# EAGLE design WIMv2 (EAGLE 7.7.0)
COMPANY: ADAFRUIT INDUSTRIES; DRAWN: KTOWN; REV: F
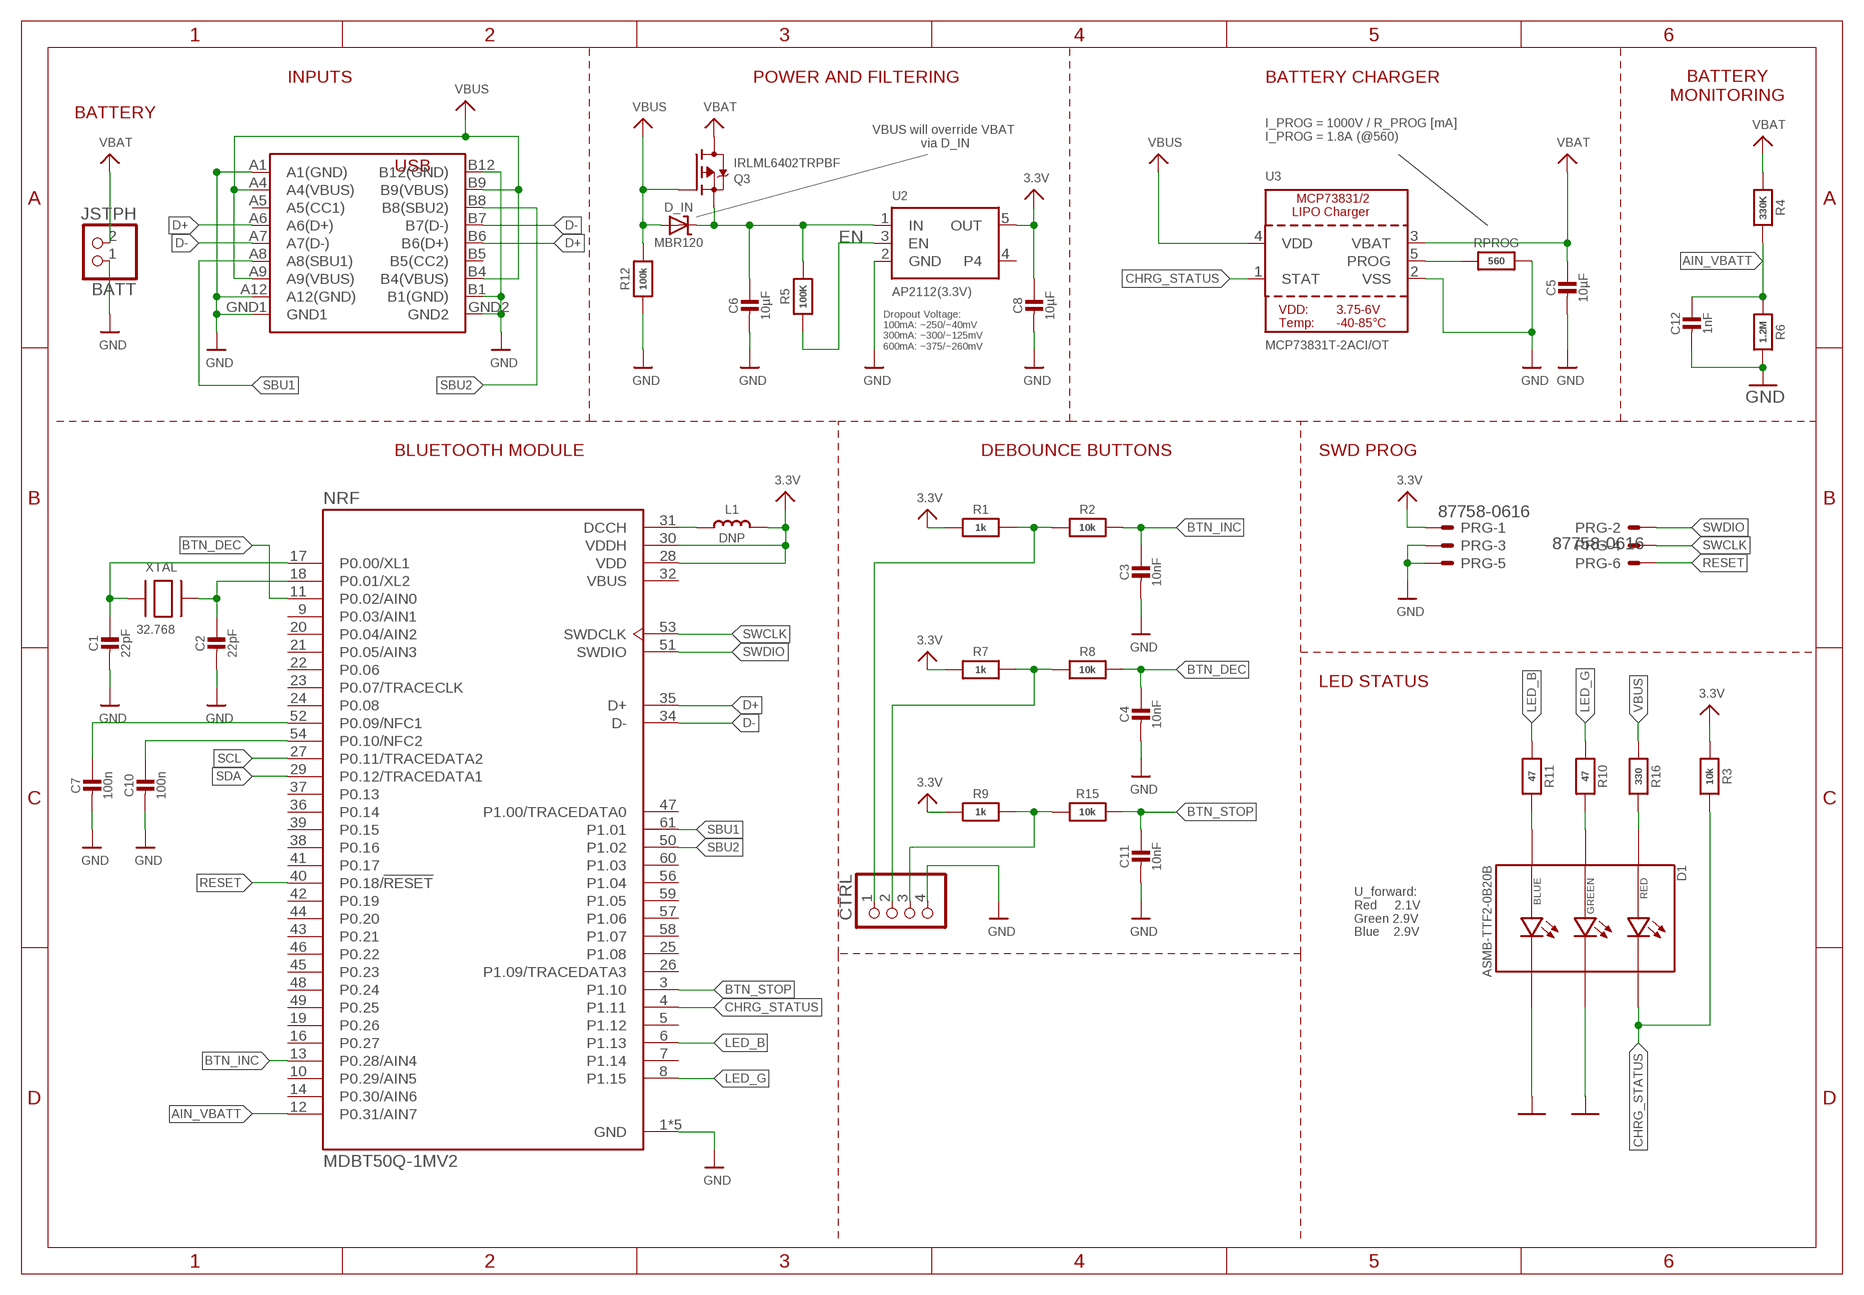
[diagram p0: schematic, sheet 1]

## Parts
BATT  JSTPH  CON_JST_PH_2PIN  [JSTPH2]
C1  22pF  CAP_CERAMIC0603_NO  [0603-NO]
C2  22pF  CAP_CERAMIC0603_NO  [0603-NO]
C3  10nF  CAP_CERAMIC0603_NO  [0603-NO]
C4  10nF  CAP_CERAMIC0603_NO  [0603-NO]
C5  10µF  CAP_CERAMIC0805-NOOUTLINE  [0805-NO]
C6  10µF  CAP_CERAMIC0805-NOOUTLINE  [0805-NO]
C7  100n  CAP_CERAMIC0603_NO  [0603-NO]
C8  10µF  CAP_CERAMIC0805-NOOUTLINE  [0805-NO]
C10  100n  CAP_CERAMIC0603_NO  [0603-NO]
C11  10nF  CAP_CERAMIC0603_NO  [0603-NO]
C12  1nF  CAP_CERAMIC0603_NO  [0603-NO]
CTRL  PINHD-1X4/90  [1X04/90]
D1  ASMB-TTF2-0B20B  [LED_ASMB-TTF2-0B20B]
D_IN  MBR120  DIODE-SCHOTTKYSOD-123  [SOD-123]
L1  DNP  INDUCTOR_0805MP  [_0805MP]
NRF  MDBT50Q-1MV2  [XCVR_MDBT50Q-1MV2]
PRG  87758-0616  [87758-0616]
Q3  IRLML6402TRPBF  MOSFET-P  [SOT23-R]
R1  1k  RESISTOR_0603_NOOUT  [0603-NO]
R2  10k  RESISTOR_0603_NOOUT  [0603-NO]
R3  10k  RESISTOR_0603_NOOUT  [0603-NO]
R4  330K  RESISTOR_0603_NOOUT  [0603-NO]
R5  100K  RESISTOR_0603_NOOUT  [0603-NO]
R6  1.2M  RESISTOR_0603_NOOUT  [0603-NO]
R7  1k  RESISTOR_0603_NOOUT  [0603-NO]
R8  10k  RESISTOR_0603_NOOUT  [0603-NO]
R9  1k  RESISTOR_0603_NOOUT  [0603-NO]
R10  47  RESISTOR_0603_NOOUT  [0603-NO]
R11  47  RESISTOR_0603_NOOUT  [0603-NO]
R12  100k  RESISTOR_0603_NOOUT  [0603-NO]
R15  10k  RESISTOR_0603_NOOUT  [0603-NO]
R16  330  RESISTOR_0603_NOOUT  [0603-NO]
RPROG  560  RESISTOR_0603_NOOUT  [0603-NO]
U2  AP2112(3.3V)  VREG_SOT23-5  [SOT23-5]
U3  MCP73831T-2ACI/OT  MCP73831/2  [SOT23-5]
USB-C  USB-C  203615-0003  [203615-0003]
XTAL  32.768  XTAL-3.2X1.5  [XTAL3215]

## Nets
3.3V: C8.1 L1.2 NRF.28(VDD) NRF.30(VDDH) PRG.1 R1.1 R3.1 R7.1 R9.1 U2.5(OUT)
AIN_VBATT: C12.1 NRF.12(P0.31/AIN7) R4.2 R6.1
BTN_DEC: C4.1 NRF.11(P0.02/AIN0) R8.2
BTN_INC: C3.1 NRF.13(P0.28/AIN4) R2.2
BTN_STOP: C11.1 NRF.3(P1.10) R15.2
CHRG_STATUS: D1.2(R_C) NRF.4(P1.11) R3.2 U3.1(STAT)
D+: NRF.35(D+) USB-C.A6(A6(D+)) USB-C.B6(B6(D+))
D-: NRF.34(D-) USB-C.A7(A7(D-)) USB-C.B7(B7(D-))
DCCH: L1.1 NRF.31(DCCH)
EN: R5.1 U2.3(EN)
GND [power]: BATT.1 C1.2 C2.2 C3.2 C4.2 C5.2 C6.2 C7.2 C8.2 C10.2 C11.2 C12.2 CTRL.4 D1.4(G_C) D1.6(B_C) NRF.1(GND) NRF.2(GND) NRF.15(GND) NRF.33(GND) NRF.55(GND) PRG.3 PRG.5 R6.2 R12.1 RPROG.2 U2.2(GND) U3.2(VSS) USB-C.A1(A1(GND)) USB-C.A12(A12(GND)) USB-C.B1(B1(GND)) USB-C.B12(B12(GND)) USB-C.GND1 USB-C.GND2
LED_B: NRF.6(P1.13) R11.1
LED_G: NRF.8(P1.15) R10.1
N$1: C1.1 NRF.17(P0.00/XL1) XTAL.P$1
N$2: C2.1 NRF.18(P0.01/XL2) XTAL.P$2
N$3: CTRL.1 R1.2 R2.1
N$4: CTRL.3 R9.2 R15.1
N$5: CTRL.2 R7.2 R8.1
N$7: D1.3(G_A) R10.2
N$8: D1.5(B_A) R11.2
N$10: RPROG.1 U3.5(PROG)
N$12: D1.1(R_A) R16.2
N$17: C7.1 NRF.52(P0.09/NFC1)
N$18: C10.1 NRF.54(P0.10/NFC2)
RESET: NRF.40(P0.18/!RESET) PRG.6
SBU1: NRF.61(P1.01) USB-C.A8(A8(SBU1))
SBU2: NRF.50(P1.02) USB-C.B8(B8(SBU2))
SCL: NRF.27(P0.11/TRACEDATA2)
SDA: NRF.29(P0.12/TRACEDATA1)
SWCLK: NRF.53(SWDCLK) PRG.4
SWDIO: NRF.51(SWDIO) PRG.2
VBAT [power]: BATT.2 C5.1 Q3.3(D) R4.1 U3.3(VBAT)
VBUS: D_IN.A Q3.1(G) R12.2 R16.1 U3.4(VDD) USB-C.A4(A4(VBUS)) USB-C.A9(A9(VBUS)) USB-C.B4(B4(VBUS)) USB-C.B9(B9(VBUS))
VIN: C6.1 D_IN.C Q3.2(S) R5.2 U2.1(IN)
Unconnected: NRF.5(P1.12) NRF.7(P1.14) NRF.9(P0.03/AIN1) NRF.10(P0.29/AIN5) NRF.14(P0.30/AIN6) NRF.16(P0.27) NRF.19(P0.26) NRF.20(P0.04/AIN2) NRF.21(P0.05/AIN3) NRF.22(P0.06) NRF.23(P0.07/TRACECLK) NRF.24(P0.08) NRF.25(P1.08) NRF.26(P1.09/TRACEDATA3) NRF.36(P0.14) NRF.37(P0.13) NRF.38(P0.16) NRF.39(P0.15) NRF.41(P0.17) NRF.42(P0.19) NRF.43(P0.21) NRF.44(P0.20) NRF.45(P0.23) NRF.46(P0.22) NRF.47(P1.00/TRACEDATA0) NRF.48(P0.24) NRF.49(P0.25) NRF.56(P1.04) NRF.57(P1.06) NRF.58(P1.07) NRF.59(P1.05) NRF.60(P1.03) U2.4 USB-C.A5(A5(CC1)) USB-C.B5(B5(CC2))

## Notes on the sheet
- INPUTS | POWER AND FILTERING | BATTERY CHARGER
- BATTERY
  MONITORING
- BATTERY
- VBUS will override VBAT 
  via D_IN
- I_PROG = 1000V / R_PROG [mA]
  I_PROG = 1.8A (@560)
- USB
- Dropout Voltage:
  100mA: ~250/~40mV
  300mA: ~300/~125mV
  600mA: ~375/~260mV
- BLUETOOTH MODULE | DEBOUNCE BUTTONS | SWD PROG
- LED STATUS
- U_forward:
  Red     2.1V
  Green 2.9V
  Blue    2.9V

## Power pins joined to a net without a drawn wire
VBUS: NRF.32(VBUS)

## Library data of the parts
BATT = microbuilder:CON_JST_PH_2PIN: JST 2-Pin Right-Angle Connector PH-Series - 4UConnector: 17311 SH-Series - 4UConnector: 07278
C1-C8 C10-C12 = microbuilder:CAP_CERAMIC: Ceramic Capacitors For new designs, use the packages preceded by an '_' character since they are more reliable: The following footprints should be used on most boards: _0402 - Standard footprint for regular board layouts _0603 - Standard footprint for regular board layouts _0805 - Standard footprint for regular board layouts _1206 - Standard footprint for regular board layouts For extremely tight-pitch boards where space is at a premium, the following 'micro-pitch' footprints can be used (smaller pads, no silkscreen outline, etc.): _0402MP - Micro-pitch footprint for very dense/compact boards _0603MP - Micro-pitch footprint for very dense/compact boards _0805MP - Micro-pitch footprint for very dense/compact boards _1206MP - Micro-pitch footprint for very dense/compact boards
CTRL = pinhead:PINHD-1X4: PIN HEADER
D1 = ASMB-TTF2-0B20B:ASMB-TTF2-0B20B: Check availability <https://pricing.snapeda.com/parts/ASMB-TTF2-0B20B/Broadcom%20/%20Avago/view-part?ref=eda>; AVAILABILITY: In Stock; DESCRIPTION: LED RGB DIFFUSED 6PLCC SMD; MF: Broadcom / Avago; MP: ASMB-TTF2-0B20B; PACKAGE: None; PRICE: None; PURCHASE-URL: https://pricing.snapeda.com/search/part/ASMB-TTF2-0B20B/?ref=eda
D_IN = microbuilder:DIODE-SCHOTTKY
L1 = microbuilder:INDUCTOR: Inductors 0603: 10nH Ceramic Inductor - microwire antenna/RF (Digikey: 712-1434-2-ND) 0805: 560nH Ceramic Inductor - RF (Digikey: 553-1047-1-ND) 270nH Ceramic Inductor - Q = 40@250MHz, +-5%, 1 Ohm DC Resistance (Digikey: 535-10506-2-ND) 1007 (2518 Metric) SMT: 10µH 10% 250mOhm 820mA 1007 Inductor (Digikey: 587-2189-1-ND) 22µH 10% 500mOhm 580mA 1007 Inductor (Digikey: 587-2190-1-ND) 47µH 10% 950mOhm 420mA 1007 Inductor (Digikey: 587-2191-1-ND) 47µH 5% 100mOhm 1A 1008 Inductor (Digikey: 732-1816-1-ND) 5.0x5.0mm (Taiyo Yuden NR5040 Series) 6.8µH 20% 2.3A 64mOhm Inductor (Digikey: 587-2374-2-ND) 5.0x5.0mm (TDK VLC5045 Series) 4.7µH 20% 3.3A 34mOhm Inductor (Digikey: 445-6526-1-ND) 6.8µH 20% 2.7A 46mOhm Inductor (Digikey: 445-6527-1-ND) 6.0x6.0mm (TDK VLC6045 Series) 4.7µH 20% 3.8A 27mOhm Inductor (Digikey: 445-6538-2-ND) 6.8µH 20% 3A 41mOhm Inductor (Digikey: 445-6540-1-ND) 6.2µH 30% 2.2A 45mOhm Inductor (Digikey: SRR5028-6R2YCT-ND) - Not TDK VLC6045 but footprint should match 6.0x6.0mm (TDK SLF6045 Series) 6.8uH 30% 2A 33mOhm Inductor (Digikey: 445-4572-1-ND, Mouser: 810-SLF645T6R8N2R0PF) 6.0x6.0mm (Sumida CDRH5D28 Series) 6.2uH 30% 1.8A 45mOhm Inductor (Digikey: 308-1542-1-ND) Taiyo Yuden NR3015T2R2M - 2.2uH 20% 1.5A (Digikey: 587-1648-2-ND, Mouser: 963-NR3015T2R2M) - Used with TI TPS62172 CoilCraft RFID Transponder Coil - MA5532-AE (For use with AS3935 Lightning Sensor) Taiyo Yuden NRH2412T2R2MNGH - 2.2uH 20% 1AA (Digikey: 587-3443-1-ND) - Used with TI LM3671 Vishay IHLP 1.0uH Molded Inductor - 24mOhm DCR, 5A, +/-20%, -55°C-125°C (Digikey: 541-1319-1-ND)
NRF = MDBT50Q-1MV2:MDBT50Q-1MV2: Embedded 2.4GHz transceiver support Bluetooth V5.0 and 802.15.4 Check availability <https://pricing.snapeda.com/parts/MDBT50Q-1MV2/Raytac%20Corporation/view-part?ref=eda>; AVAILABILITY: In Stock; DESCRIPTION: 802.15.4, Bluetooth Bluetooth v5.2, Zigbee® Transceiver Module 2.36GHz ~ 2.5GHz Integrated, Chip Surface Mount; MF: Raytac Corporation; MP: MDBT50Q-1MV2; PACKAGE: SMD-61 Raytac Corporation; PRICE: None; PURCHASE-URL: https://pricing.snapeda.com/search/part/MDBT50Q-1MV2/?ref=eda
PRG = con-molex:87758-0616: 6 Pin - 2mm Dual Row Single Wafer, Vertical T/H HDR Source: http://www.molex.com/pdm_docs/sd/877580616_sd.pdf; MPN: 87758-0616; OC_FARNELL: 7472323; OC_NEWARK: 25M5667
Q3 = microbuilder:MOSFET-P: P-Channel Mosfet LEGEND VDS: Voltage Drain-Source ID: Drain Current RDS(ON): Drain-Source On-State Resistance VGS(TH): Gate-Source Threshold Voltage CISS: Drain-Source Input Capacitance SOT-23 Name VDS ID RDS(ON) VGS(TH) CISS Order Number IRLML5103 30V 760mA 600 mOhm -- 75pF @ 25V Digikey: IRLML5103PBFCT-ND IRLML6401 12V 4.3A 50 mOhm 950mV @ 250µA 830pF @ 10V Digikey: IRLML6401PBFTR-ND NTR0202PL 20V 400mA 800 mOhm 2.3V @ 250uA 70pF @ 5V Digikey: NTR0202PLT1GOSTR-ND NTR4101PT1G 20V 1.8A 85 mOhm 1.2V @ 250uA 675pF @ 10V Digikey: NTR4101PT1GOSCT-ND DMP2004K 20V 600mA 900 mOhm 1V @ 250uA 175pF @ 16V Digikey: DMP2004KDICT-ND PMV65XP 20V 3.9A 76 mOhm 950mV @ 1mA 725pF @ 20V Digikey: 568-2358-2-ND TO-252 Name VDS ID RDS(ON) VGS(TH) CISS Order Number AOD417 30V 25A 34 mOhm 3V @ 250µA 920pF @ 15V Digikey: 785-1106-2-ND PowerPak Name VDS ID RDS(ON) VGS(TH) CISS Order Number AON7401 30V 12A 14 mOhm 3V @ 250µA 2600pF @ 15V Digikey: 785-1302-1-ND
R1-R12 R15 R16 RPROG = microbuilder:RESISTOR: Resistors For new designs, use the packages preceded by an '_' character since they are more reliable: The following footprints should be used on most boards: _0402 - Standard footprint for regular board layouts _0603 - Standard footprint for regular board layouts _0805 - Standard footprint for regular board layouts _1206 - Standard footprint for regular board layouts For extremely tight-pitch boards where space is at a premium, the following 'micro-pitch' footprints can be used (smaller pads, no silkscreen outline, etc.): _0402MP - Micro-pitch footprint for very dense/compact boards _0603MP - Micro-pitch footprint for very dense/compact boards _0805MP - Micro-pitch footprint for very dense/compact boards _1206MP - Micro-pitch footprint for very dense/compact boards
U2 = microbuilder:VREG_SOT23-5: SOT23-5 Fixed Voltage Regulators Part Current Out V Out V In V Dropout θJA (°C/W) TJ (°C) Digikey Part No. ADP121 150mA 3.3V 3.4-5.5V 0.09V @ 150mA -- -- ADP121-AUJZ33R7CT-ND ADP121 150mA 3.0V 3.1-5.5V 0.09V @ 150mA -- -- ADP121-AUJZ30R7CT-ND ADP122 300mA 3.3V 3.4-5.5V 0.085V @ 300mA -- -- ADP122AUJZ-3.3-R7CT-ND ADP1712 300mA 3.3V 3.5-5.5V 0.17V @ 300mA -- -- ADP1712AUJZ-3.3-R7TR-ND AP7311 (Low Cost) 150mA 3.3V 3.5-6V 0.15V @ 150mA -- -- AP7311-33WG-7DICT-ND LD39015M18R 150mA 1.8V 1.9V-5.5V 0.08V @ 100mA -- -- 497-6977-1-ND LP2985A-33DBVR 150mA 3.3V 3.3-16V 0.28V @ 150mA 206 150 296-18479-1-ND MCP1824T-3302E/OT 300mA 3.3V 3.5V-6V 0.2V @ 300mA -- -- MCP1824T-3302E/OTCT-ND MIC5205-2.5YM5 TR 150mA 2.5V 2.7-16V 0.165V @ 150mA -- -- 576-1257-2-ND MIC5205-3.0YM5 TR 150mA 3.0V 3.2V-16V 0.165V @ 150mA -- -- 576-1258-2-ND MIC5205-3.3YM5 TR 150mA 3.3V 3.5V-16V 0.165V @ 150mA -- -- 576-1259-2-ND TPS780330220 150mA 3.3V+2.2V 3.6-5.5V 250mV Max -- -- 296-23332-1-ND TDA3663/N1,135 100mA 3.3V 3.5-45V 0.18V @ 50mA -- -- 568-5343-1-ND Max operating temp can be calculated using θJA, TJ (max junction temperature), and power in watts. Set the "Maximum Ambient Temperature" until it reaches TJ ("Max Junction Temperature"), which is the absolute limit for safe use of the regulator: Heat Sink Temperature Calculator <http://www.daycounter.com/Calculators/Heat-Sink-Temperature-Calculator.phtml> For example, With 12V source into a 3.3V LP2985 and a 30mA load, we are dissipating (12V-3.3V) * 0.03A = 0.261W. With a θJA of 206 °C/W, a TJ of 150°C, and 261mW we can safely use the chip without a heat sink up to 75°C (=147.1°C Junction Temperature).
U3 = microbuilder:MCP73831/2: MCP73831/2 LIPO Charger VDD: 3.75 - 6V Temp -40 - 85°C Programmable Charge Rate: 15-500mA NOTE: STAT is a tri-state logic output on the MCP73831 and an open-drain output on the MCP73832. SOT23-5 with 4.2V output and tri-state logic on STAT = MCP73831T-2ACI/OT
USB-C = christian:203615-0003
XTAL = adafruit2:XTAL: Low cost SMT crystals, no capacitors included http://www.ladyada.net/library/eagle

## Net classes
1 power: width 0.254 mm
3 usbvcc: width 0.305 mm, drill 0.483 mm, clearance 0.203 mm

## Board
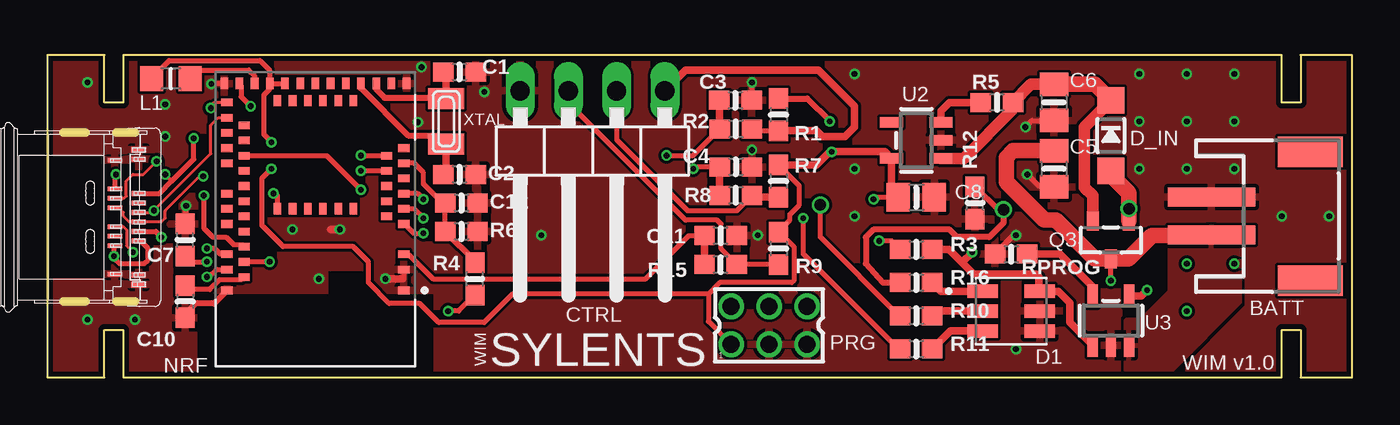
[diagram p1: board, top side]
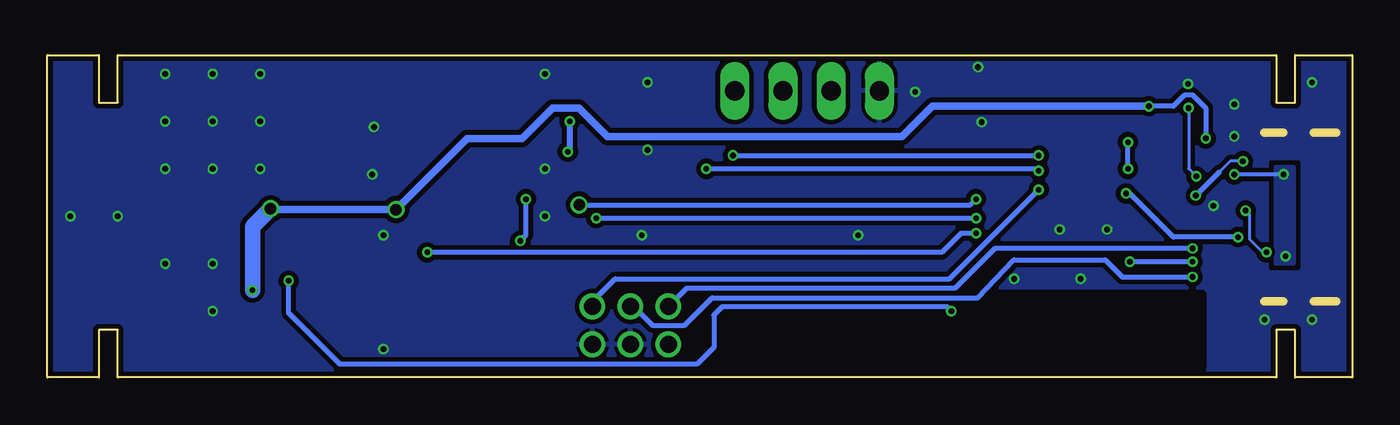
[diagram p2: board, bottom side, seen from below]

Size 68.7 x 17 mm. Coordinates in mm from the lower left corner, seen from the top.
Outline: 0,0 3,0 3,2.5 4,2.5 4,0 65,0 65,2.5 66,2.5 66,0 68.7,0 68.7,17 66,17 66,14.5 65,14.5 65,17 4,17 4,14.5 3,14.5 3,17 0,17 0,0
Copper layers (1*16): Top 0.018mm / dielectric 1.55mm / Bottom 0.018mm
Design rules "eC_2Layer_PClass6_BaseCopperO18_eCDefault": minimum track width 0.15mm, minimum drill 0.35mm, track to track 0.15mm, track to pad 0.15mm, pad to pad 0.15mm, via to via 0.15mm, smd to smd 0mil, copper to edge 0.25mm, drill to drill 0.35mm, minimum pad ring 0.175mm, minimum via ring 0.125mm, stop-mask expansion 0mil, vias tented up to drill 0.45mm, thermal gap 0.2mm

### Footprints (pad centres in the part's own frame; a part is rotated, then mirrored left to right if it is on the bottom)
JSTPH2 = smd 1 x 4.6: 1 -1,-3.7; 2 1,-3.7 | smd 1.6 x 3.4: NC1 -3.4,1.5; NC2 3.4,1.5
0603-NO = smd 1.075 x 1: 1 -0.85,0; 2 0.85,0
0805-NO = smd 1.24 x 1.5: 1 -0.95,0; 2 0.95,0
1X04/90 = drill 1.016 long: 1 -3.81,-3.81; 2 -1.27,-3.81; 3 1.27,-3.81; 4 3.81,-3.81
LED_ASMB-TTF2-0B20B = smd 1.6 x 0.7: 1 -1.5,1.05; 2 1.5,1.05; 3 -1.5,0; 4 1.5,0; 5 -1.5,-1.05; 6 1.5,-1.05
SOD-123 = smd 1.4 x 1.4: A 1.85,0; C -1.85,0
_0805MP = smd 1.2 x 1.3: 1 -1.016,0; 2 1.016,0
XCVR_MDBT50Q-1MV2 = smd 0.6 x 0.4: 1 -4.65,3.75; 2 -4.65,2.65; 3 -4.65,1.85; 4 -4.65,0.25; 5 -3.75,-0.15; 6 -4.65,-0.55; 7 -3.75,-0.95; 8 -4.65,-1.35; 9 -3.75,-1.75; 10 -4.65,-2.15; 11 -3.75,-2.55; 12 -4.65,-2.95; 13 -3.75,-3.35; 14 -4.65,-3.75; 34 4.65,-6.15; 35 4.65,-5.35; 36 3.75,-4.95; 37 4.65,-4.55; 38 3.75,-4.15; 39 4.65,-3.75; 40 3.75,-3.35; 41 4.65,-2.95; 42 3.75,-2.55; 43 3.75,-1.75; 44 4.65,-1.35; 45 3.75,-0.95; 46 4.65,-0.55; 47 3.75,-0.15; 48 4.65,0.25; 49 3.75,0.65; 50 3.75,1.45; 51 4.65,1.85; 52 3.75,2.25; 53 4.65,2.65; 54 3.75,3.05; 55 4.65,3.75 | smd 0.4 x 0.6: 15 -4.8,-7.15; 16 -4,-7.15; 17 -3.2,-7.15; 18 -2.4,-7.15; 19 -2,-6.25; 20 -1.6,-7.15; 21 -1.2,-6.25; 22 -0.8,-7.15; 23 -0.4,-6.25; 24 0,-7.15; 25 0.4,-6.25; 26 0.8,-7.15; 27 1.2,-6.25; 28 1.6,-7.15; 29 2,-6.25; 30 2.4,-7.15; 31 3.2,-7.15; 32 4,-7.15; 33 4.8,-7.15; 56 -2,-0.55; 57 -1.2,-0.55; 58 -0.4,-0.55; 59 0.4,-0.55; 60 1.2,-0.55; 61 2,-0.55
87758-0616 = drill 0.9 pad 1.27: 1 -2,-1; 2 -2,1; 3 0,-1; 4 0,1; 5 2,-1; 6 2,1
SOT23-R = smd 0.635 x 1.016: 1 -0.95,-1; 2 0.95,-1; 3 0,1
SOT23-5 = smd 0.55 x 1.2: 1 -0.95,-1.3; 2 0,-1.3; 3 0.95,-1.3; 4 0.95,1.3; 5 -0.95,1.3
203615-0003 = smd 0.25 x 0.75: A1 -3.05,7.5; A4 -1.25,7.5; A5 -0.75,7.5; A6 -0.25,7.5; A7 0.25,7.5; A8 0.75,7.5; A9 1.25,7.5; A12 3.05,7.5; B1 3,6.25; B4 1.5,6.25; B5 1,6.25; B6 0.5,6.25; B7 -0.5,6.25; B8 -1,6.25; B9 -1.5,6.25; B12 -3,6.25 | smd 0.3 x 0.8: GND1 -3.55,7.5; GND2 3.55,7.5
XTAL3215 = smd 1.1 x 1.9: P$1 1.2,0; P$2 -1.2,0

### Placement (x,y rotation side)
BATT  65,8.5 270 top
C1  21.7,16.1 0 top
C2  21.7,10.7 0 top
C3  36.23,14.61 0 top
C4  36.25,11.1 0 top
C5  53,11 270 top
C6  53,14.5 270 top
C7  7.25,7.25 90 top
C8  45.75,9.5 0 top
C10  7.25,4 270 top
C11  35.45,7.48 0 top
C12  21.8,9.2 0 top
CTRL  28.7,11.3 180 top
D1  50.75,3.5 0 top
D_IN  56,12.75 270 top
L1  6.5,15.75 180 top
NRF  14.11,8.34 180 top
PRG  38,2.75 0 top
Q3  56,7.25 180 top
R1  38.5,13.85 270 top
R2  36.25,13.1 180 top
R3  45.75,6.75 0 top
R4  22.51,5.2 90 top
R5  50,14.5 0 top
R6  21.8,7.7 0 top
R7  38.5,10.35 270 top
R8  36.25,9.6 180 top
R9  38.5,6.8 270 top
R10  45.75,3.25 0 top
R11  45.75,1.5 0 top
R12  48.85,9.2 90 top
R15  35.45,5.95 180 top
R16  45.75,5 0 top
RPROG  50.75,6.5 180 top
U2  45.75,12.5 90 top
U3  56,3 0 top
USB-C  -2.7,8.45 270 top
XTAL  21,13.5 90 top

### Tracks (layer width: path | path; a pad name or v marks a point on that pad's centre or on a via)
3.3V  (via drill 0.3)
  Top 0.254: R7.1 39.6,10.1 39.6,9.1 39.1,8.6 39.1,8.3 38.5,7.7 R9.1 38.55,7.65 39.3,6.9 39.3,5.1 39.2,5 35.4,5 34.8,4.4 | 34.8,4.4 34.8,2.95 PRG.1 | L1.2 5.58,15.88 6.4,16.7 11.2,16.7 11.7,16.2 NRF.30 | NRF.30 NRF.28 | 34.8,4.4 24.5,4.4 23,2.9 20.6,2.9 19.6,3.9 18,3.9 16.9,5 16.9,6.1 16.1,6.9 12.4,6.9 11.3,8 11.3,10.5 v11.8,11 | v11.8,12.4 11.4,12.8 11.4,14.9 11.71,15.21 NRF.30 | R3.1 44.45,7.2 v43.8,7.2 | v43.5,9.4 43.6,9.5 C8.1
  Top 0.305: R1.1 40,14.7 v41.2,13.5
  Top 0.406: C8.1 44.45,9.85 U2.5 44.1,11.9 v41.3,11.9 41.2,11.9 40.5,11.2 R7.1
  Bottom 0.254: v11.8,11 v11.8,12.4 | v43.8,7.2 43.5,7.5 v43.5,9.4
  Bottom 0.305: v41.2,13.5 41.2,12 v41.3,11.9
AIN_VBATT
  Top 0.254: 21,7.65 R6.1 C12.1 20.8,9.2 19.8,10.2 19.8,10.8 19.3,11.3 NRF.12
  Top 0.305: 21,7.65 22.51,6.14 R4.2
BTN_DEC  (via drill 0.3)
  Top 0.254: C4.1 34.1,11.1 v34,11 | v16.5,10.9 NRF.11
  Top 0.406: R8.2 C4.1
  Bottom 0.254: v34,11 16.6,11 v16.5,10.9
BTN_INC  (via drill 0.3)
  Top 0.254: v16.5,11.7 NRF.13 | v32.6,11.7 34,11.7 R2.2
  Top 0.406: C3.1 35.4,14.59 R2.2
  Bottom 0.254: v32.6,11.7 v16.5,11.7
BTN_STOP
  Top 0.254: NRF.3 19.01,6.49 20.3,5.2 31.5,5.2 33.78,7.48 C11.1
  Top 0.406: C11.1 R15.2
CHRG_STATUS  (via drill 0.3)
  Top 0.254: NRF.4 18.81,8.09 19.3,7.6 v19.8,7.6
  Top 0.406: U3.1 53.85,2.9 53.85,3.93 53.23,4.55 D1.2 52.2,4.6 52.2,5.3 52.05,5.45 48.77,5.45 48.16,6.06 | 48.16,6.06 47.47,6.75 R3.2 | v48.7,6.6 48.16,6.06
  Bottom 0.254: v19.8,7.6 20.6,7.6 21.6,6.6 v48.7,6.6
D+  (via drill 0.3)
  Top 0.15: USB-C.B6 3.99,7.95 4.16,7.78 4.16,6.94 v4.5,6.6 | USB-C.A6 5.5,8.7 v5.6,8.8 8.6,11.8 8.6,13.3 8.99,13.69 NRF.35
  Bottom 0.15: v4.5,6.6 4.7,6.6 5.4,7.3 5.4,8.6 v5.6,8.8
D-  (via drill 0.3)
  Top 0.15: USB-C.B7 3.75,8.95 4,8.7 4,8.5 4.3,8.2 USB-C.A7 6,8.2 6.2,8.4 6.2,8.8 8,10.6 v8.2,10.6 | NRF.34 8.79,14.49 v8.6,14.2
  Bottom 0.15: v8.6,14.2 8.6,11 v8.2,10.6
DCCH
  Top 0.254: 7.55,15.55 L1.1 8.07,16.2 10.6,16.2 10.9,15.9 NRF.31
EN
  Top 0.406: U2.3 47.05,14.05 47.5,14.5 R5.1
GND  (via drill 0.3)
  Top 0.254: v51.5,13.2 51.85,13.55 C6.2 | v51.6,10.7 52.2,10.1 53,10.1 | C3.2 37.1,14.63 37.1,15.5 | NRF.2 18.76,5.26 18.7,5.2 | NRF.33 v8.63,15.48
  Top 0.305: RPROG.2 50.9,7.5 v51,7.5 | NRF.55 8.77,3.9 7.8,3.9 7.25,3.35 C10.2 | v7.3,9.05 7.25,9 C7.2
  Top 0.406: v15.4,7.8 14.9,7.8 | v17.8,5.2 18.7,5.2
  other vias: 57.5,16 60,16 62.5,16 62.5,13.5 62.5,11 57.5,13.5 60,13.5 60,11 57.5,11 37.1,15.55 42.5,16 42.5,11 42.5,8.5 60,3.5 60,6 62.5,6 65,8.5 67.5,8.5 2.1,3.05 4.6,3.05 2.1,15.55 51,1.5 23,15.06 26,7.5 12.9,7.8 37.1,11.99 6.2,12.7 6.2,14.4 19.7,16.36 14.3,5.2 37.4,7.5 19.5,13.46
  pour Top (rank 3): -5,-1.5 70,-1.5 70,18.5 -5,18.5
  pour Bottom (isolate 0.254, rank 2): -5,-1.5 70,-1.5 70,18.5 -5,18.5
LED_B  (via drill 0.3)
  Top 0.254: R11.1 44.8,1.5 39.8,6.5 v39.8,8.4 | v19.8,8.4 19.31,8.89 NRF.6
  Bottom 0.254: v39.8,8.4 v19.8,8.4
LED_G  (via drill 0.3, 0.6)
  Top 0.254: R10.1 44.85,3.25 40.7,7.4 v40.7,9.1 | v19.8,9.4 19.51,9.69 NRF.8
  Bottom 0.254: v40.7,9.1 20.1,9.1 v19.8,9.4
N$1
  Top 0.305: NRF.17 17.31,15.19 17.75,14.75 20.95,14.75 XTAL.P$1
  Top 0.406: 21.2,14.5 XTAL.P$1 21,16.1 C1.1
N$2
  Top 0.305: NRF.18 16.51,15.24 19,12.75 20.55,12.75 XTAL.P$2
  Top 0.406: C2.1 21,10.7 XTAL.P$2
N$3
  Top 0.254: 37.2,13 R1.2
  Top 0.406: R2.1 37.2,13 | CTRL.1 33.6,16.2 40.6,16.2 42.5,14.3 42.5,13.2 42,12.7 40.8,12.7 40.5,13 R1.2
N$4
  Top 0.254: CTRL.3 27.43,14.47 33.6,8.3 35.27,8.3 35.47,8.1 35.47,6.78 R15.1 R9.2
N$5
  Top 0.254: CTRL.2 29.97,12.53 33.7,8.8 36.3,8.8 R8.1
  Top 0.406: R8.1 37.2,9.5 R7.2
N$7
  Top 0.406: R10.2 46.85,3.5 D1.3
N$8
  Top 0.406: R11.2 47.55,2.45 D1.5
N$10
  Top 0.406: U3.5 54.99,4.36 54.99,4.82 53.31,6.5 RPROG.1
N$12
  Top 0.406: R16.2 47.05,4.55 D1.1
N$17  (via drill 0.3)
  Top 0.254: C7.1 7.55,6.1 v8.4,6.1 | v11.7,6.1 v11.69,6.09 NRF.52
  Bottom 0.254: v8.4,6.1 v11.7,6.1
N$18
  Top 0.254: NRF.54 10.22,5.15 9.06,5.15 8.55,4.64 7.46,4.64 arc-90 C10.1
RESET  (via drill 0.3)
  Top 0.254: NRF.40 14.71,11.69 v16.5,9.9
  Bottom 0.254: PRG.6 40,4 38.8,5.2 21.2,5.2 v16.5,9.9
SBU1  (via drill 0.3)
  Top 0.254: USB-C.A8 5.7,7.7 v6,7.4 | v11.9,9.7 12,9.7 12.1,9.6 NRF.61
  Bottom 0.254: v6,7.4 9.4,7.4 11.7,9.7 v11.9,9.7
SBU2  (via drill 0.3)
  Top 0.15: USB-C.B8 4.04,9.45 4.15,9.56 4.15,10.35 4.5,10.7 5.05,10.7 v5.75,11.4
  Top 0.254: v8.23,9.59 8.23,7.87 8.7,7.4 9.4,7.4 9.8,7 10.25,7 arc-90 NRF.50
  Bottom 0.15: v5.75,11.4 6.42,11.4 7,10.82
  Bottom 0.254: 7,10.82 v8.23,9.59
SWCLK  (via drill 0.3)
  Top 0.254: v8.4,5.3 8.5,5.3 8.9,5.7 NRF.53
  Bottom 0.254: PRG.4 37.85,3.75 36.85,2.75 35.15,2.75 33.7,4.2 19.7,4.2 17.8,6.2 13,6.2 12.1,5.3 v8.4,5.3
SWDIO  (via drill 0.3)
  Top 0.254: NRF.51 9.11,6.49 8.8,6.8 v8.4,6.8
  Bottom 0.254: v8.4,6.8 18.8,6.8 20.9,4.7 35.05,4.7 PRG.2
VBAT  (via drill 0.3)
  Top 0.254: v56,5.1 Q3.3 | R4.1 21.66,3.5 v21.1,3.5
  Top 0.813: BATT.2 61.28,7.48 58.17,7.48 56.93,6.25 Q3.3 55.15,6.25 53.1,8.3 52.5,8.3 50.5,10.3 50.5,11.6 50.85,11.95 C5.1
  Bottom 0.254: v56,5.1 56,3.4 53.3,0.7 34.5,0.7 33.6,1.6 33.6,3.3 33.17,3.73 22,3.73 21.53,3.73 21.33,3.73 v21.1,3.5
  pour Top: 56.8,3 56.8,0.4 59.2,0.4 62.8,4 62.8,7.9 59.6,7.9 59.1,7.4 59.1,4.5 57.6,3
VBUS  (via drill 0.3, 0.6)
  Top 0.2: v6.2,10.7 6.55,10.35
  Top 0.254: v7.7,12.6 7.7,11.5 6.55,10.35 5.9,9.7 USB-C.A4 | v10.7,14.3 10.2,14.8 10.2,15.4 NRF.32 | v3.6,10.7 3.55,10.65 USB-C.B9 | USB-C.B4 3.5,6.9 v3.5,6.4 3.5,6.3 3.8,6 5.1,6 5.3,6.2 5.3,6.8 4.9,7.2 USB-C.A9
  Top 0.305: R16.1 44,5 43.1,6 43.1,7.4 43.5,7.8 47.5,7.8 47.9,7.4 49.6,7.4 50.35,8.15 v50.35,8.85 50.05,8.85 R12.2
  Top 0.406: U3.4 57.6,4.3 v57.9,4.6
  Top 0.813: D_IN.A 56,10.67 56.95,9.72 v56.95,8.9 Q3.1
  Bottom 0.2: v3.6,10.7 v6.2,10.7
  Bottom 0.254: v10.7,14.3 9.4,14.3 8.8,14.9 8.4,14.9 7.7,14.2 v7.7,12.6
  Bottom 0.406: 56.9,8.85 v50.35,8.85 46.6,12.6 43.7,12.6 42.1,14.2 40.7,14.2 39.2,12.7 23.7,12.7 22.1,14.3 v10.7,14.3
  Bottom 0.61: 56.9,8.85 v56.95,8.9
  Bottom 0.813: v57.9,4.6 57.9,7.95 v56.95,8.9
  pour Bottom: 3.1,6 4,6 4,11.1 3.1,11.1
VIN
  Top 0.61: U2.1 48.26,11.55 50.85,14.14 R5.2 | 50.8,14.45 R5.2 | 52.91,15.36 C6.1 51.8,15.45 R5.2 | D_IN.C 54.61,13.21 54.61,10.02 55.05,9.58 Q3.2
  Top 0.813: C6.1 55.15,15.45 D_IN.C

### Text on the board
tNames: WIM v1.0 | WIM | SYLENTS